# Altium project Sayma_AMC.PrjPcb (part 10 of 18)

## Sheet I2C_MUX.SchDoc: Sayma AMC
size 420 x 297 mm; $$Internal___BlkDate: 0:12:25_2-9-18; $$Internal_NAME_PLACEHOLDER: a3sheet; $$Internal_Resolution: 00001mm; $$NotCommonProperty_@NAME: I2C_MUX; $$NotCommonProperty_@PRINTORDER: 12; $$NotCommonProperty_@SHEET: 1; $$NotCommonProperty_@SHEETTOTAL: 30; CmpIndex: 31; Drawing Author: G.Kasprowicz; Drawing Number: Sayma AMC; Drawing Project: AMC FMC Carrier Board; Drawing Revision: 2.0; SymIndex: 2141; CheckedBy: P.Kulik,T.Przywozki,W.Ruclo; Author: G.Kasprowicz; CompanyName: WUT ISE; DrawnBy: G.Kasprowicz; Organization: WUT ISE; Address1: PW ISE; Address2: Nowowiejska 15/19 00-665 Warsaw; Address3: gkasprow@gmail.com; DocumentNumber: 9; Revision: 2; SheetNumber: 9; SheetTotal: 32; ModifiedBy: -; CheckedDate: -; Title2: I2C switches; DivGrp: WUT ISE; Designer: G.Kasprowicz; ModifiedDate: -; ProjectName: Sensor Box
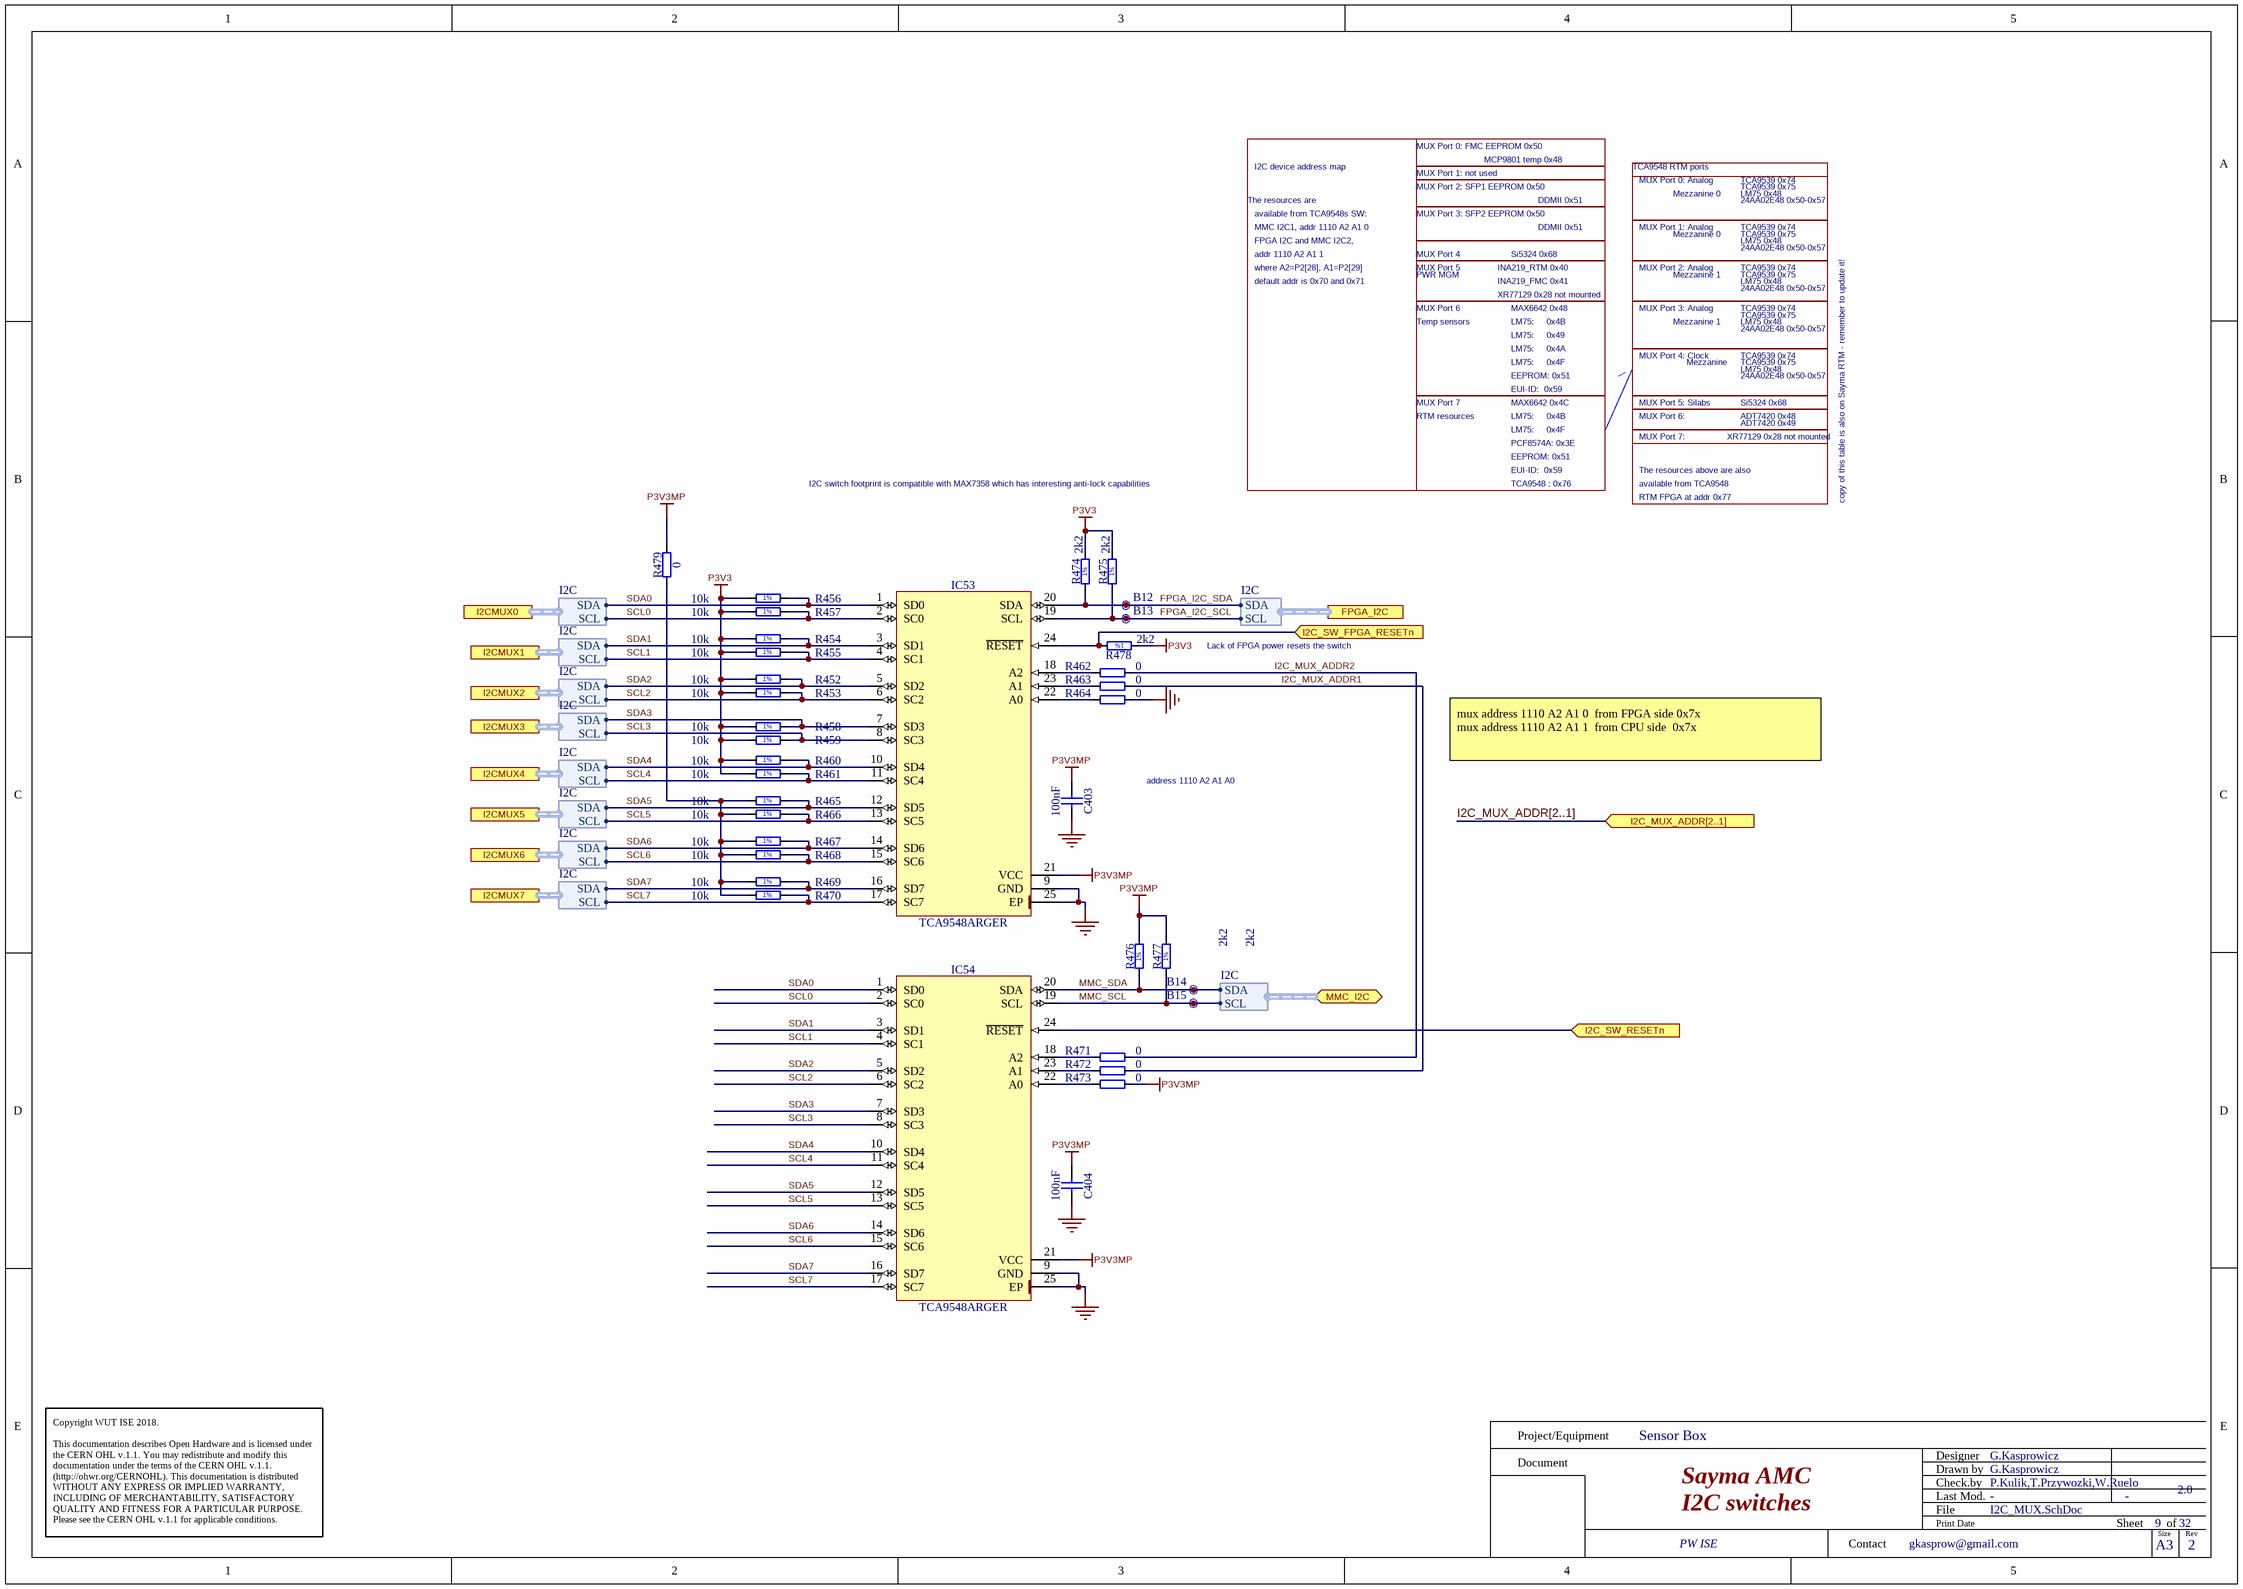
[diagram p16: I2C_MUX.SchDoc]

### Parts
B12  SMD_PAD_D1MM  [C100]  (value not drawn)
B13  SMD_PAD_D1MM  [C100]  (value not drawn)
B14  SMD_PAD_D1MM  [C100]  (value not drawn)
B15  SMD_PAD_D1MM  [C100]  (value not drawn)
C403  100nF  [CAPC0603X33N]
C404  100nF  [CAPC0603X33N]
IC53  TCA9548ARGER  [QFN50P400X400X100-25N-S220]
IC54  TCA9548ARGER  [QFN50P400X400X100-25N-S220]
R452  10k  [RESC1005X40N]
R453  10k  [RESC1005X40N]
R454  10k  [RESC1005X40N]
R455  10k  [RESC1005X40N]
R456  10k  [RESC1005X40N]
R457  10k  [RESC1005X40N]
R458  10k  [RESC1005X40N]
R459  10k  [RESC1005X40N]
R460  10k  [RESC1005X40N]
R461  10k  [RESC1005X40N]
R462  0  [RESC1005X40N]
R463  0  [RESC1005X40N]
R464  0  [RESC1005X40N]
R465  10k  [RESC1005X40N]
R466  10k  [RESC1005X40N]
R467  10k  [RESC1005X40N]
R468  10k  [RESC1005X40N]
R469  10k  [RESC1005X40N]
R470  10k  [RESC1005X40N]
R471  0  [RESC1005X40N]
R472  0  [RESC1005X40N]
R473  0  [RESC1005X40N]
R474  2k2  [RESC1005X40N]
R475  2k2  [RESC1005X40N]
R476  2k2  [RESC1005X40N]
R477  2k2  [RESC1005X40N]
R478  2k2  [RESC1005X40N]
R479  0  [RESC1005X40N]

### Ports
FPGA_I2C (harness I2C), I2C_MUX_ADDR[2..1] (in), I2C_SW_FPGA_RESETn (in), I2C_SW_RESETn (in), I2CMUX0 (harness I2C), I2CMUX1 (harness I2C), I2CMUX2 (harness I2C), I2CMUX3 (harness I2C), I2CMUX4 (harness I2C), I2CMUX5 (harness I2C), I2CMUX6 (harness I2C), I2CMUX7 (harness I2C), MMC_I2C (bidir, harness I2C)

### Harnesses
I2C: SCL, SDA

### Nets
GND: C403.2 C404.2 IC53.9(GND) IC53.25(EP) IC54.9(GND) IC54.25(EP) R464.1
P3V3: R452.1 R453.1 R454.1 R455.1 R456.1 R457.1 R458.1 R459.1 R460.1 R461.1 R474.2 R475.2 R478.1
P3V3MP: C403.1 C404.1 IC53.21(VCC) IC54.21(VCC) R473.1 R476.2 R477.2 R479.1
FPGA_I2C_SCL: B13.1 IC53.19(SCL) R475.1 ; port FPGA_I2C.SCL
FPGA_I2C_SDA: B12.1 IC53.20(SDA) R474.1 ; port FPGA_I2C.SDA
I2C_MUX_ADDR1: R463.1 R472.1
I2C_MUX_ADDR2: R462.1 R471.1
I2C_SW_FPGA_RESETn: IC53.24(~{RESET}) R478.2 ; port I2C_SW_FPGA_RESETn
MMC_SCL: B15.1 IC54.19(SCL) R477.1 ; port MMC_I2C.SCL
MMC_SDA: B14.1 IC54.20(SDA) R476.1 ; port MMC_I2C.SDA
SCL0: IC53.2(SC0) IC54.2(SC0) R457.2 ; port I2CMUX0.SCL  [project net FMC_SCL]
SCL1: IC53.4(SC1) IC54.4(SC1) R455.2 ; port I2CMUX1.SCL
SCL2: IC53.6(SC2) IC54.6(SC2) R453.2 ; port I2CMUX2.SCL
SCL3: IC53.8(SC3) IC54.8(SC3) R459.2 ; port I2CMUX3.SCL
SCL4: IC53.11(SC4) IC54.11(SC4) R461.2 ; port I2CMUX4.SCL
SCL5: IC53.13(SC5) IC54.13(SC5) R466.2 ; port I2CMUX5.SCL  [project net PM_SCL]
SCL6: IC53.15(SC6) IC54.15(SC6) R468.2 ; port I2CMUX6.SCL
SCL7: IC53.17(SC7) IC54.17(SC7) R470.2 ; port I2CMUX7.SCL  [project net RTM_SCL]
SDA0: IC53.1(SD0) IC54.1(SD0) R456.2 ; port I2CMUX0.SDA  [project net FMC_SDA]
SDA1: IC53.3(SD1) IC54.3(SD1) R454.2 ; port I2CMUX1.SDA
SDA2: IC53.5(SD2) IC54.5(SD2) R452.2 ; port I2CMUX2.SDA
SDA3: IC53.7(SD3) IC54.7(SD3) R458.2 ; port I2CMUX3.SDA
SDA4: IC53.10(SD4) IC54.10(SD4) R460.2 ; port I2CMUX4.SDA
SDA5: IC53.12(SD5) IC54.12(SD5) R465.2 ; port I2CMUX5.SDA  [project net PM_SDA]
SDA6: IC53.14(SD6) IC54.14(SD6) R467.2 ; port I2CMUX6.SDA
SDA7: IC53.16(SD7) IC54.16(SD7) R469.2 ; port I2CMUX7.SDA  [project net RTM_SDA]
NetIC51_E5: IC54.24(~{RESET}) ; port I2C_SW_RESETn
NetIC53_18: IC53.18(A2) R462.2
NetIC53_22: IC53.22(A0) R464.2
NetIC53_23: IC53.23(A1) R463.2
NetIC54_18: IC54.18(A2) R471.2
NetIC54_22: IC54.22(A0) R473.2
NetIC54_23: IC54.23(A1) R472.2
NetR465_1: R465.1 R466.1 R467.1 R468.1 R469.1 R470.1 R479.2

### Buses and harness runs
bus I2C_MUX_ADDR[2..1] = port I2C_MUX_ADDR[2..1]

### Notes on the sheet
- I2C device address map
- MUX Port 0: FMC EEPROM 0x50
- MUX Port 1: not used
- MUX Port 2: SFP1 EEPROM 0x50
- MCP9801 temp 0x48
- TCA9548 RTM ports
- MUX Port 0: Analog
- TCA9539 0x74
- TCA9539 0x75
- The resources are
- FPGA I2C and MMC I2C2,
- available from TCA9548s SW:
- MMC I2C1, addr 1110 A2 A1 0
- addr 1110 A2 A1 1
- MUX Port 3: SFP2 EEPROM 0x50
- MUX Port 4
- Si5324 0x68
- DDMII 0x51
- MUX Port 1: Analog
- Mezzanine 0
- 24AA02E48 0x50-0x57
- LM75 0x48
- where A2=P2[28], A1=P2[29]
- default addr is 0x70 and 0x71
- MUX Port 5
- MUX Port 6
- Temp sensors
- PWR MGM
- INA219_RTM 0x40
- INA219_FMC 0x41
- XR77129 0x28 not mounted
- MAX6642 0x48
- LM75:     0x4B
- MUX Port 2: Analog
- MUX Port 3: Analog
- Mezzanine 1
- EUI-ID:  0x59
- LM75:     0x49
- LM75:     0x4A
- LM75:     0x4F
- EEPROM: 0x51
- MUX Port 4: Clock
- Mezzanine
- MUX Port 7
- RTM resources
- MAX6642 0x4C
- PCF8574A: 0x3E
- MUX Port 5: Silabs
- MUX Port 6:
- MUX Port 7:
- ADT7420 0x48
- ADT7420 0x49
- I2C switch footprint is compatible with MAX7358 which has interesting anti-lock capabilities
- TCA9548 : 0x76
- The resources above are also
- available from TCA9548
- RTM FPGA at addr 0x77
- copy of this table is also on Sayma RTM - remember to update it!
- Lack of FPGA power resets the switch
- address 1110 A2 A1 A0
- mux address 1110 A2 A1 0  from FPGA side 0x7x
  mux address 1110 A2 A1 1  from CPU side  0x7x
- Project/Equipment
- Document
- Designer
- Drawn by
- Check.by
- Copyright WUT ISE 2018.
  This documentation describes Open Hardware and is licensed under the CERN OHL v.1.1. You may redistribute and modify this documentation under the terms of the CERN OHL v.1.1. (http://ohwr.org/CERNOHL). This documentation is distributed WITHOUT ANY EXPRESS OR IMPLIED WARRANTY, INCLUDING OF MERCHANTABILITY, SATISFACTORY QUALITY AND FITNESS FOR A PARTICULAR PURPOSE. Please see the CERN OHL v.1.1 for applicable conditions.
- Contact
- File
- Last Mod.
- Print Date
- Sheet
- Size
- A3
- of
- Rev
- (in symbol R0402_2K2_1%_0.0625W_100PPM) 1%
- (in symbol R0402_10k_1%_0.0625W_100PPM) 1%

### Library data of the parts
B12 = C100: $$NotCommonProperty_Partition: Pads; Part Description: 1mm Diameter SMD Pad; $$Internal_Resolution: 00001mm; $$NotCommonProperty_Family: SMD Pad; $$NotCommonProperty_Mounted: No; $$NotCommonProperty_Pin Count: 1; $$NotCommonProperty_Sense: No; $$NotCommonProperty_Status: None; CmpIndex: 39; Ref Designator: B12; SymIndex: 2108; $$NotCommonProperty_ComponentHeight: 0mm; $$NotCommonProperty_Footprint Ref: C100; $$NotCommonProperty_SMD: No; $$NotCommonProperty_Socket: No; Cell Name: C100; PackageDescription: 1mm Diameter SMD Pad; Part Name: SMD_PAD_D1MM; Part Number: SMD_PAD_D1MM; Orientation: 0 = 0
B13 = C100: $$NotCommonProperty_Partition: Pads; Part Description: 1mm Diameter SMD Pad; $$Internal_Resolution: 00001mm; $$NotCommonProperty_Family: SMD Pad; $$NotCommonProperty_Mounted: No; $$NotCommonProperty_Pin Count: 1; $$NotCommonProperty_Sense: No; $$NotCommonProperty_Status: None; CmpIndex: 41; Ref Designator: B13; SymIndex: 2108; $$NotCommonProperty_ComponentHeight: 0mm; $$NotCommonProperty_Footprint Ref: C100; $$NotCommonProperty_SMD: No; $$NotCommonProperty_Socket: No; Cell Name: C100; PackageDescription: 1mm Diameter SMD Pad; Part Name: SMD_PAD_D1MM; Part Number: SMD_PAD_D1MM; Orientation: 0 = 0
B14 = C100: $$NotCommonProperty_Partition: Pads; Part Description: 1mm Diameter SMD Pad; $$Internal_Resolution: 00001mm; $$NotCommonProperty_Family: SMD Pad; $$NotCommonProperty_Mounted: No; $$NotCommonProperty_Pin Count: 1; $$NotCommonProperty_Sense: No; $$NotCommonProperty_Status: None; CmpIndex: 44; Ref Designator: B14; SymIndex: 2108; $$NotCommonProperty_ComponentHeight: 0mm; $$NotCommonProperty_Footprint Ref: C100; $$NotCommonProperty_SMD: No; $$NotCommonProperty_Socket: No; Cell Name: C100; PackageDescription: 1mm Diameter SMD Pad; Part Name: SMD_PAD_D1MM; Part Number: SMD_PAD_D1MM; Orientation: 0 = 0
B15 = C100: $$NotCommonProperty_Partition: Pads; Part Description: 1mm Diameter SMD Pad; $$Internal_Resolution: 00001mm; $$NotCommonProperty_Family: SMD Pad; $$NotCommonProperty_Mounted: No; $$NotCommonProperty_Pin Count: 1; $$NotCommonProperty_Sense: No; $$NotCommonProperty_Status: None; CmpIndex: 43; Ref Designator: B15; SymIndex: 2108; $$NotCommonProperty_ComponentHeight: 0mm; $$NotCommonProperty_Footprint Ref: C100; $$NotCommonProperty_SMD: No; $$NotCommonProperty_Socket: No; Cell Name: C100; PackageDescription: 1mm Diameter SMD Pad; Part Name: SMD_PAD_D1MM; Part Number: SMD_PAD_D1MM; Orientation: 0 = 0
C403 C404 = CC0201_100NF_6.3V_10%_X5R: as C1 on sheet SI5324_CDR_WR_oscillators; Manufacturer Part Number: CC0201_100NF_6.3V_10%_X5R; Part Number: CC0201_100NF_6.3V_10%_X5R; Value: 100nF; Component Kind: Standard; Component Type: Standard; Pin Count: 2; Status: Not Recommended; Case: 0201; Mounted: Yes; Socket: No; SMD: Yes; Sense: No; Manufacturer1 Example: AVX; Manufacturer1 ComponentHeight: 0.33mm; HelpURL: \\cern.ch\dfs\Applications\Altium\Datasheets\CC0201_X5R_AVX.pdf; Author: CERN DEM JLC; CreateDate: 03.12.2007; LatestRevisionDate: 03.12.2007
IC53 IC54 = TCA9548ARGER: Low Voltage 8-Channel I2C Switch With Reset; Manufacturer: TEXAS INSTRUMENTS; PressFit: No; Bonding: No; Manufacturer Part Number: TCA9548ARGER; PackageDescription: QFN, 0.50mm Pitch, Square; 24 Pin, 4.00mm L X 4.00mm W X 1.00mm H body (w/thermal tab 2.2 X 2.2mm), IPC Medium Density; Part Description: Low Voltage 8-Channel I2C Switch With Reset; Part Number: TCA9548ARGER; Component Kind: Standard; Component Type: Standard; Device: TCA9548ARGER; Pin Count: 25; Case: QFN24; Mounted: Yes; Socket: No; SMD: Yes; Sense: No; ComponentHeight: 1mm; Author: CERN DEM JLC; HelpURL: \\cern.ch\dfs\Applications\Altium\Datasheets\TCA9548ARGER.pdf; CreateDate: 07.07.2014; LatestRevisionDate: 07.07.2014
R452-R461 R465-R470 = R0402_10k_1%_0.0625W_100PPM: Resistor - 1%; Manufacturer: GENERIC; Part Description: General Purpose Thick Film Chip Resistor; Manufacturer1 Part Number: 232270671003L; TC: ±100ppm/°C; PressFit: No; Manufacturer Part Number: R0402_10K_1%_0.0625W_100PPM; Part Number: R0402_10K_1%_0.0625W_100PPM; Tolerance: ±1%; Value: 10k; Component Kind: Standard; Component Type: Standard; Pin Count: 2; Status: Not Recommended; Power: 0.0625W; Case: 0402; Mounted: Yes; Sense: No; Socket: No; SMD: Yes; Manufacturer1 Example: YAGEO PHYCOMP; Manufacturer1 ComponentHeight: 0.4mm; HelpURL: \\cern.ch\dfs\Applications\Altium\Datasheets\R0402_Phycomp_RC0402.pdf; Author: CERN DEM JLC; CreateDate: 03.12.2007; LatestRevisionDate: 17.10.2012
R462-R464 R471-R473 R479 = R0402_0R_JUMPER: as R372 on sheet SI5324_CDR_WR_oscillators; Manufacturer Part Number: R0402_0R_JUMPER; Part Number: R0402_0R_JUMPER; Value: 0; Component Kind: Standard; Component Type: Standard; Pin Count: 2; Status: Not Recommended; Case: 0402; Mounted: Yes; Sense: No; Socket: No; SMD: Yes; Manufacturer1 Example: YAGEO PHYCOMP; Manufacturer1 ComponentHeight: 0.4mm; HelpURL: \\cern.ch\dfs\Applications\Altium\Datasheets\R0402_Phycomp_RC0402.pdf; Author: CERN DEM JLC; CreateDate: 03.12.2007; LatestRevisionDate: 17.10.2012
R474-R478 = R0402_2K2_1%_0.0625W_100PPM: Resistor - 1%; Manufacturer: GENERIC; Part Description: General Purpose Thick Film Chip Resistor; Manufacturer1 Part Number: 232270672202L; TC: ±100ppm/°C; PressFit: No; Manufacturer Part Number: R0402_2K2_1%_0.0625W_100PPM; Part Number: R0402_2K2_1%_0.0625W_100PPM; Tolerance: ±1%; Value: 2k2; Component Kind: Standard; Component Type: Standard; Pin Count: 2; Status: Not Recommended; Power: 0.0625W; Case: 0402; Mounted: Yes; Sense: No; Socket: No; SMD: Yes; Manufacturer1 Example: YAGEO PHYCOMP; Manufacturer1 ComponentHeight: 0.4mm; HelpURL: \\cern.ch\dfs\Applications\Altium\Datasheets\R0402_Phycomp_RC0402.pdf; Author: CERN DEM JLC; CreateDate: 03.12.2007; LatestRevisionDate: 17.10.2012

## Sheet Thermometers.SchDoc: Sayma AMC
size 420 x 297 mm; $$Internal___BlkDate: 0:12:25_2-9-18; $$Internal_NAME_PLACEHOLDER: a3sheet; $$Internal_Resolution: 00001mm; $$NotCommonProperty_@NAME: Thermometers; $$NotCommonProperty_@PRINTORDER: 11; $$NotCommonProperty_@SHEET: 1; $$NotCommonProperty_@SHEETTOTAL: 30; CmpIndex: 52; Drawing Author: G.Kasprowicz; Drawing Number: Sayma AMC; Drawing Project: AMC FMC Carrier Board; Drawing Revision: 2.0; SymIndex: 2141; CheckedBy: P.Kulik,T.Przywozki,W.Ruclo; Author: G.Kasprowicz; CompanyName: WUT ISE; DrawnBy: G.Kasprowicz; Organization: WUT ISE; Address1: PW ISE; Address2: Nowowiejska 15/19 00-665 Warsaw; Address3: gkasprow@gmail.com; DocumentNumber: 7; Revision: 2; SheetNumber: 7; SheetTotal: 32; ModifiedBy: -; CheckedDate: -; Title2: Thermometers & EEPROM; DivGrp: WUT ISE; Designer: G.Kasprowicz; ModifiedDate: -; ProjectName: Sensor Box
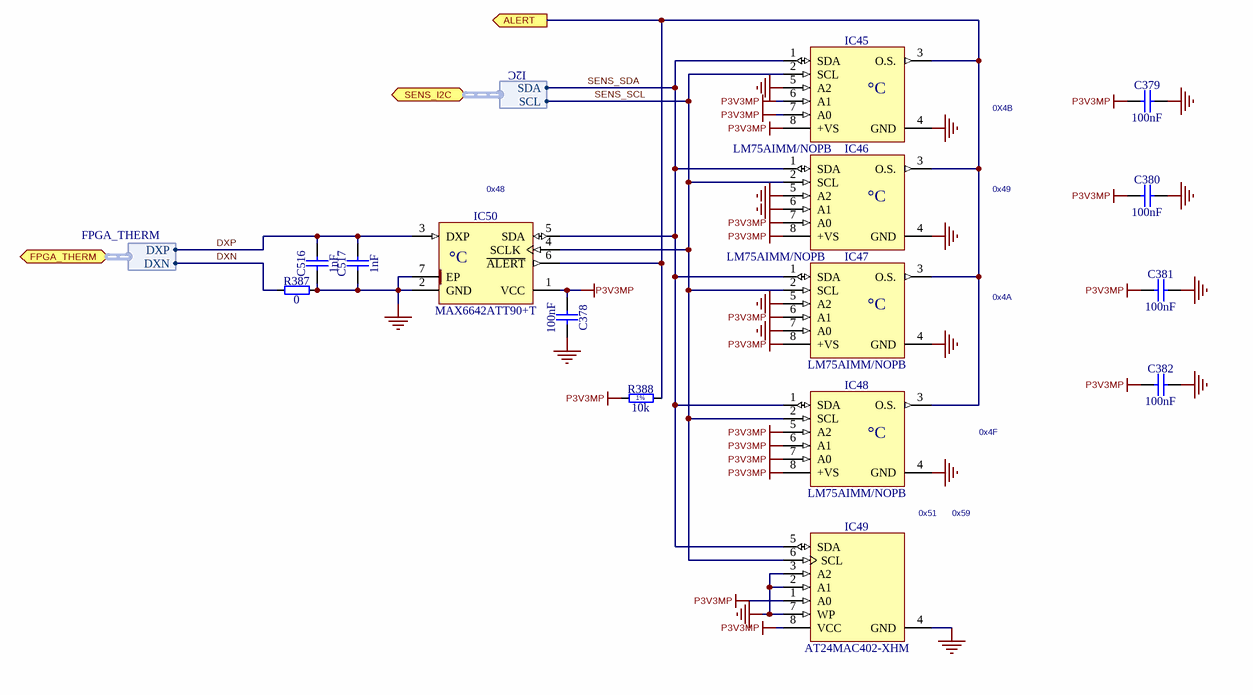
[diagram p17: Thermometers.SchDoc]

### Parts
C378  100nF  [CAPC0603X33N]
C379  100nF  [CAPC0603X33N]
C380  100nF  [CAPC0603X33N]
C381  100nF  [CAPC0603X33N]
C382  100nF  [CAPC0603X33N]
C516  1nF  [CAPC1005X55N]
C517  1nF  [CAPC1005X55N]
IC45  LM75AIMM/NOPB  [SOP65P490X109-8N]
IC46  LM75AIMM/NOPB  [SOP65P490X109-8N]
IC47  LM75AIMM/NOPB  [SOP65P490X109-8N]
IC48  LM75AIMM/NOPB  [SOP65P490X109-8N]
IC49  AT24MAC402-XHM  [SOP65P640X120-8N]
IC50  MAX6642ATT90+T  [SON95P300X300X80-7N-R160X240]
R387  0  [RESC1005X40N]
R388  10k  [RESC1005X40N]

### Ports
ALERT (out), FPGA_THERM (bidir, harness FPGA_THERM), SENS_I2C (bidir, harness I2C)

### Harnesses
FPGA_THERM: DXP, DXN
I2C: SCL, SDA

### Nets
GND: C378.1 C379.2 C380.2 C381.2 C382.2 C516.1 C517.1 IC45.4(GND) IC45.5(A2) IC46.4(GND) IC46.5(A2) IC46.6(A1) IC47.4(GND) IC47.5(A2) IC47.7(A0) IC48.4(GND) IC49.2(A1) IC49.3(A2) IC49.4(GND) IC49.7(WP) IC50.2(GND) IC50.7(EP) R387.2
P3V3MP: C378.2 C379.1 C380.1 C381.1 C382.1 IC45.6(A1) IC45.7(A0) IC45.8(+VS) IC46.7(A0) IC46.8(+VS) IC47.6(A1) IC47.8(+VS) IC48.5(A2) IC48.6(A1) IC48.7(A0) IC48.8(+VS) IC49.1(A0) IC49.8(VCC) IC50.1(VCC) R388.1
DXN: R387.1 ; port FPGA_THERM.DXN
DXP: C516.2 C517.2 IC50.3(DXP) ; port FPGA_THERM.DXP
SENS_SCL: IC45.2(SCL) IC46.2(SCL) IC47.2(SCL) IC48.2(SCL) IC49.6(SCL) IC50.4(SCLK) ; port SENS_I2C.SCL  [project net SCL6]
SENS_SDA: IC45.1(SDA) IC46.1(SDA) IC47.1(SDA) IC48.1(SDA) IC49.5(SDA) IC50.5(SDA) ; port SENS_I2C.SDA  [project net SDA6]
NetIC45_3: IC45.3(O.S.) IC46.3(O.S.) IC47.3(O.S.) IC48.3(O.S.) IC50.6(~{ALERT}) R388.2 ; port ALERT

### Notes on the sheet
- 0X4B
- (near IC50) 0x48
- 0x49
- 0x4A
- 0x4F
- 0x51
- 0x59
- Project/Equipment
- Document
- Designer
- Drawn by
- Check.by
- Copyright WUT ISE 2018.
  This documentation describes Open Hardware and is licensed under the CERN OHL v.1.1. You may redistribute and modify this documentation under the terms of the CERN OHL v.1.1. (http://ohwr.org/CERNOHL). This documentation is distributed WITHOUT ANY EXPRESS OR IMPLIED WARRANTY, INCLUDING OF MERCHANTABILITY, SATISFACTORY QUALITY AND FITNESS FOR A PARTICULAR PURPOSE. Please see the CERN OHL v.1.1 for applicable conditions.
- Contact
- File
- Last Mod.
- Print Date
- Sheet
- Size
- A3
- of
- Rev
- (in symbol LM75AIMM/NOPB) °C
- (in symbol MAX6642ATT90+T) °C
- (in symbol R0402_10K_1%_0.0625W_100PPM) 1%

### Library data of the parts
C378-C382 = CC0201_100NF_6.3V_10%_X5R: as C1 on sheet SI5324_CDR_WR_oscillators; Manufacturer Part Number: CC0201_100NF_6.3V_10%_X5R; Part Number: CC0201_100NF_6.3V_10%_X5R; Value: 100nF; Component Kind: Standard; Component Type: Standard; Pin Count: 2; Status: Not Recommended; Case: 0201; Mounted: Yes; Socket: No; SMD: Yes; Sense: No; Manufacturer1 Example: AVX; Manufacturer1 ComponentHeight: 0.33mm; HelpURL: \\cern.ch\dfs\Applications\Altium\Datasheets\CC0201_X5R_AVX.pdf; Author: CERN DEM JLC; CreateDate: 03.12.2007; LatestRevisionDate: 03.12.2007
C516 C517 = CC0402_1NF_50V_10%_X7R: Non-polarised capacitor; Manufacturer: GENERIC; Part Description: SMD Multilayer Chip Ceramic Capacitor; Manufacturer1 Part Number: 223858715623; Tolerance: ±10%; Voltage: 50V; TC: X7R; Manufacturer Part Number: CC0402_1NF_50V_10%_X7R; Part Number: CC0402_1NF_50V_10%_X7R; Value: 1nF; Component Kind: Standard; Component Type: Standard; Pin Count: 2; Status: Not Recommended; Case: 0402; Mounted: Yes; Socket: No; SMD: Yes; Sense: No; Manufacturer1 Example: PHYCOMP; Manufacturer1 ComponentHeight: 0.55mm; HelpURL: \\cern.ch\dfs\Applications\Altium\Datasheets\CC0402_X7R_PHYCOMP.pdf; Author: CERN DEM JLC; CreateDate: 03.12.2007; LatestRevisionDate: 03.12.2007
IC45-IC48 = LM75AIMM/NOPB: Digital Temperature Sensor and Thermal Watchdog with Two-Wire Interface; Manufacturer: TEXAS INSTRUMENTS; Part Description: -25° to +100°C ±2°C Digital Temperature Sensor and Thermal Watchdog with Two-Wire Interface; PressFit: No; Bonding: No; Manufacturer Part Number: LM75AIMM/NOPB; PackageDescription: SOP, 0.65mm pitch; 8 pin,3.00mm W X 3.00mm L X 1.09mm H bodyI, PC Medium Density; Part Number: LM75AIMM/NOPB; Component Kind: Standard; Component Type: Standard; Device: LM75AIMM/NOPB; Pin Count: 8; Case: SSOP8; Mounted: Yes; Socket: No; SMD: Yes; Sense: No; ComponentHeight: 1.09mm; HelpURL: \\cern.ch\dfs\Applications\Altium\Datasheets\LM75AIMM-NOPB.pdf; Author: CERN DEM JLC; CreateDate: 15.10.2012; LatestRevisionDate: 15.10.2012
IC49 = AT24MAC402-XHM: 1.7V to 5.5V, I2C-Compatible (2-wire) 2-Kbit (256 x 8) Serial EEPROM; Manufacturer: ATMEL; Part Description: 1.7V to 5.5V, I2C-Compatible (2-wire) 2-Kbit (256 x 8) Serial EEPROM with a EUI-48 Address; PressFit: No; Bonding: No; Footprint: SOP65X640X120-8N; Manufacturer Part Number: AT24MAC402-XHM; PackageDescription: SOP, 0.65mm pitch; 8 pin, 4.40mm W X 3.00mm L X 1.20mm H body, IPC Medium Density; Part Number: AT24MAC402-XHM; Component Kind: Standard; Component Type: Standard; Device: AT24MAC402-XHM; Pin Count: 8; Case: TSSOP8; Mounted: Yes; Socket: No; SMD: Yes; Sense: No; ComponentHeight: 1.2mm; HelpURL: \\cern.ch\dfs\Applications\Altium\Datasheets\AT24MAC402-XHM.pdf; Author: CERN DEM MR; CreateDate: 09.03.2016; LatestRevisionDate: 09.11.2016
IC50 = MAX6642ATT90+T: ±1°C, SMBus-Compatible Remote/Local Temperature Sensor with Overtemperature Alarm; Manufacturer: MAXIM; Part Description: 0°C to +125°C, ±1°C, SMBus-Compatible Remote/Local Temperature Sensor with Overtemperature Alarm (Address 1001 000); PressFit: No; Bonding: No; Manufacturer Part Number: MAX6642ATT90+T; PackageDescription: SON, 0.95mm Pitch; 6 Pin, 3.00mm W X 3mm L X 0.80mm H body (w/Thermal Tab 1.6mm x 2.4mm); Part Number: MAX6642ATT90+T; Component Kind: Standard; Component Type: Standard; Device: MAX6642ATT90+T; Pin Count: 7; Case: SON6; Mounted: Yes; Socket: No; SMD: Yes; Sense: No; ComponentHeight: 0.8mm; HelpURL: \\cern.ch\dfs\Applications\Altium\Datasheets\MAX6642ATT90+T.pdf; Author: CERN DEM JLC; CreateDate: 26.11.2013; LatestRevisionDate: 26.11.2013
R387 = R0402_0R_JUMPER: as R372 on sheet SI5324_CDR_WR_oscillators; Manufacturer Part Number: R0402_0R_JUMPER; Part Number: R0402_0R_JUMPER; Value: 0; Component Kind: Standard; Component Type: Standard; Pin Count: 2; Status: Not Recommended; Case: 0402; Mounted: Yes; Sense: No; Socket: No; SMD: Yes; Manufacturer1 Example: YAGEO PHYCOMP; Manufacturer1 ComponentHeight: 0.4mm; HelpURL: \\cern.ch\dfs\Applications\Altium\Datasheets\R0402_Phycomp_RC0402.pdf; Author: CERN DEM JLC; CreateDate: 03.12.2007; LatestRevisionDate: 17.10.2012
R388 = R0402_10K_1%_0.0625W_100PPM: Resistor - 1%; Manufacturer: GENERIC; Part Description: General Purpose Thick Film Chip Resistor; Manufacturer1 Part Number: 232270671003L; TC: ±100ppm/°C; PressFit: No; Manufacturer Part Number: R0402_10K_1%_0.0625W_100PPM; Part Number: R0402_10K_1%_0.0625W_100PPM; Tolerance: ±1%; Value: 10k; Component Kind: Standard; Component Type: Standard; Pin Count: 2; Status: Not Recommended; Power: 0.0625W; Case: 0402; Mounted: Yes; Sense: No; Socket: No; SMD: Yes; Manufacturer1 Example: YAGEO PHYCOMP; Manufacturer1 ComponentHeight: 0.4mm; HelpURL: \\cern.ch\dfs\Applications\Altium\Datasheets\R0402_Phycomp_RC0402.pdf; Author: CERN DEM JLC; CreateDate: 03.12.2007; LatestRevisionDate: 17.10.2012